# Altium schematic sheet A-00 COVER.SchDoc
size 513 x 386 mm
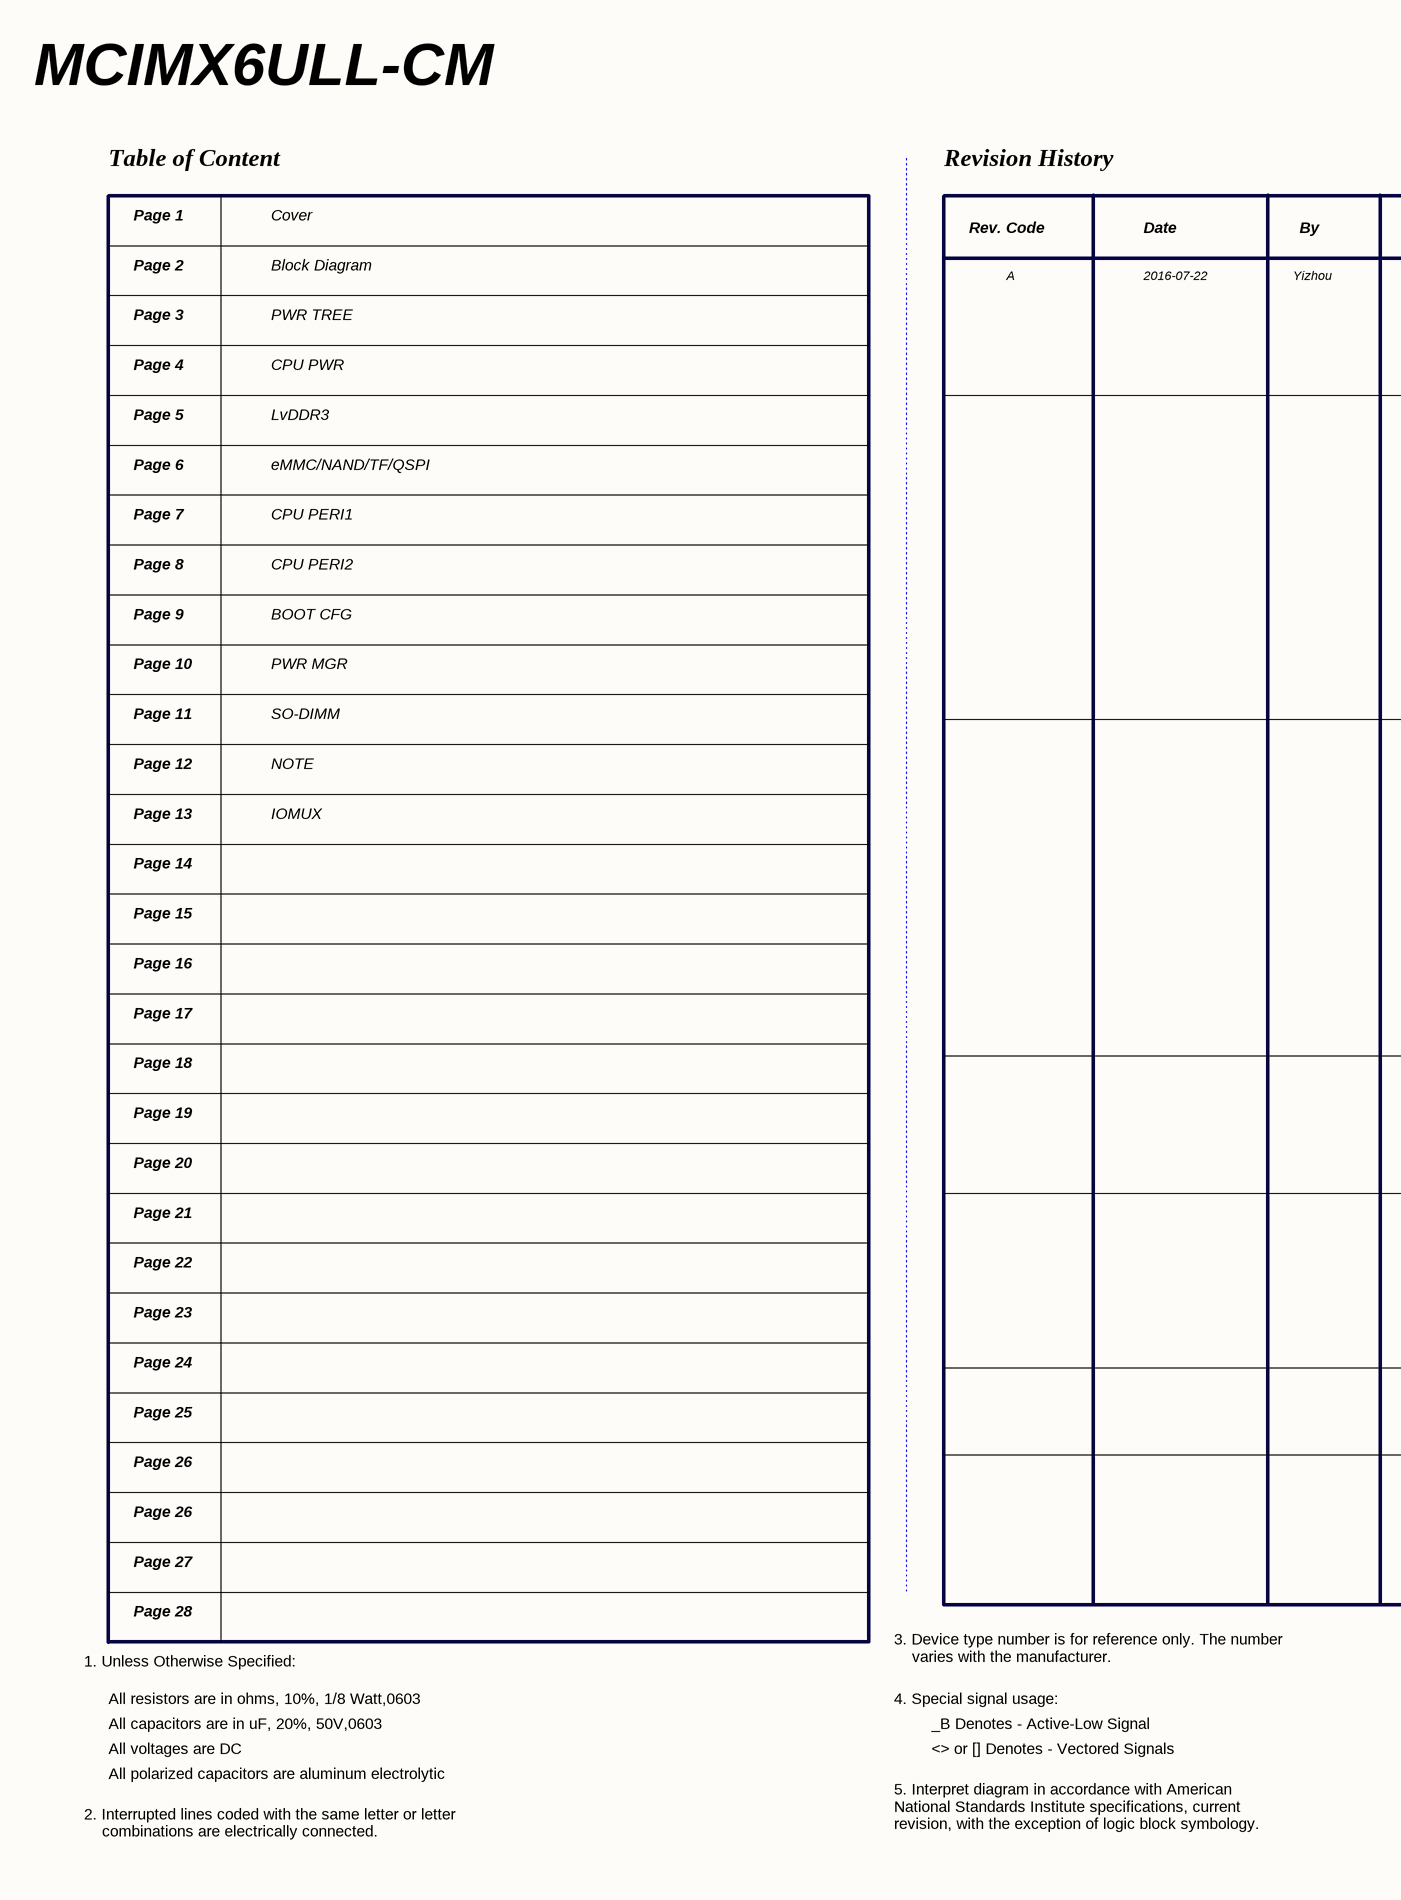
[diagram p0: A-00 COVER.SchDoc, left]
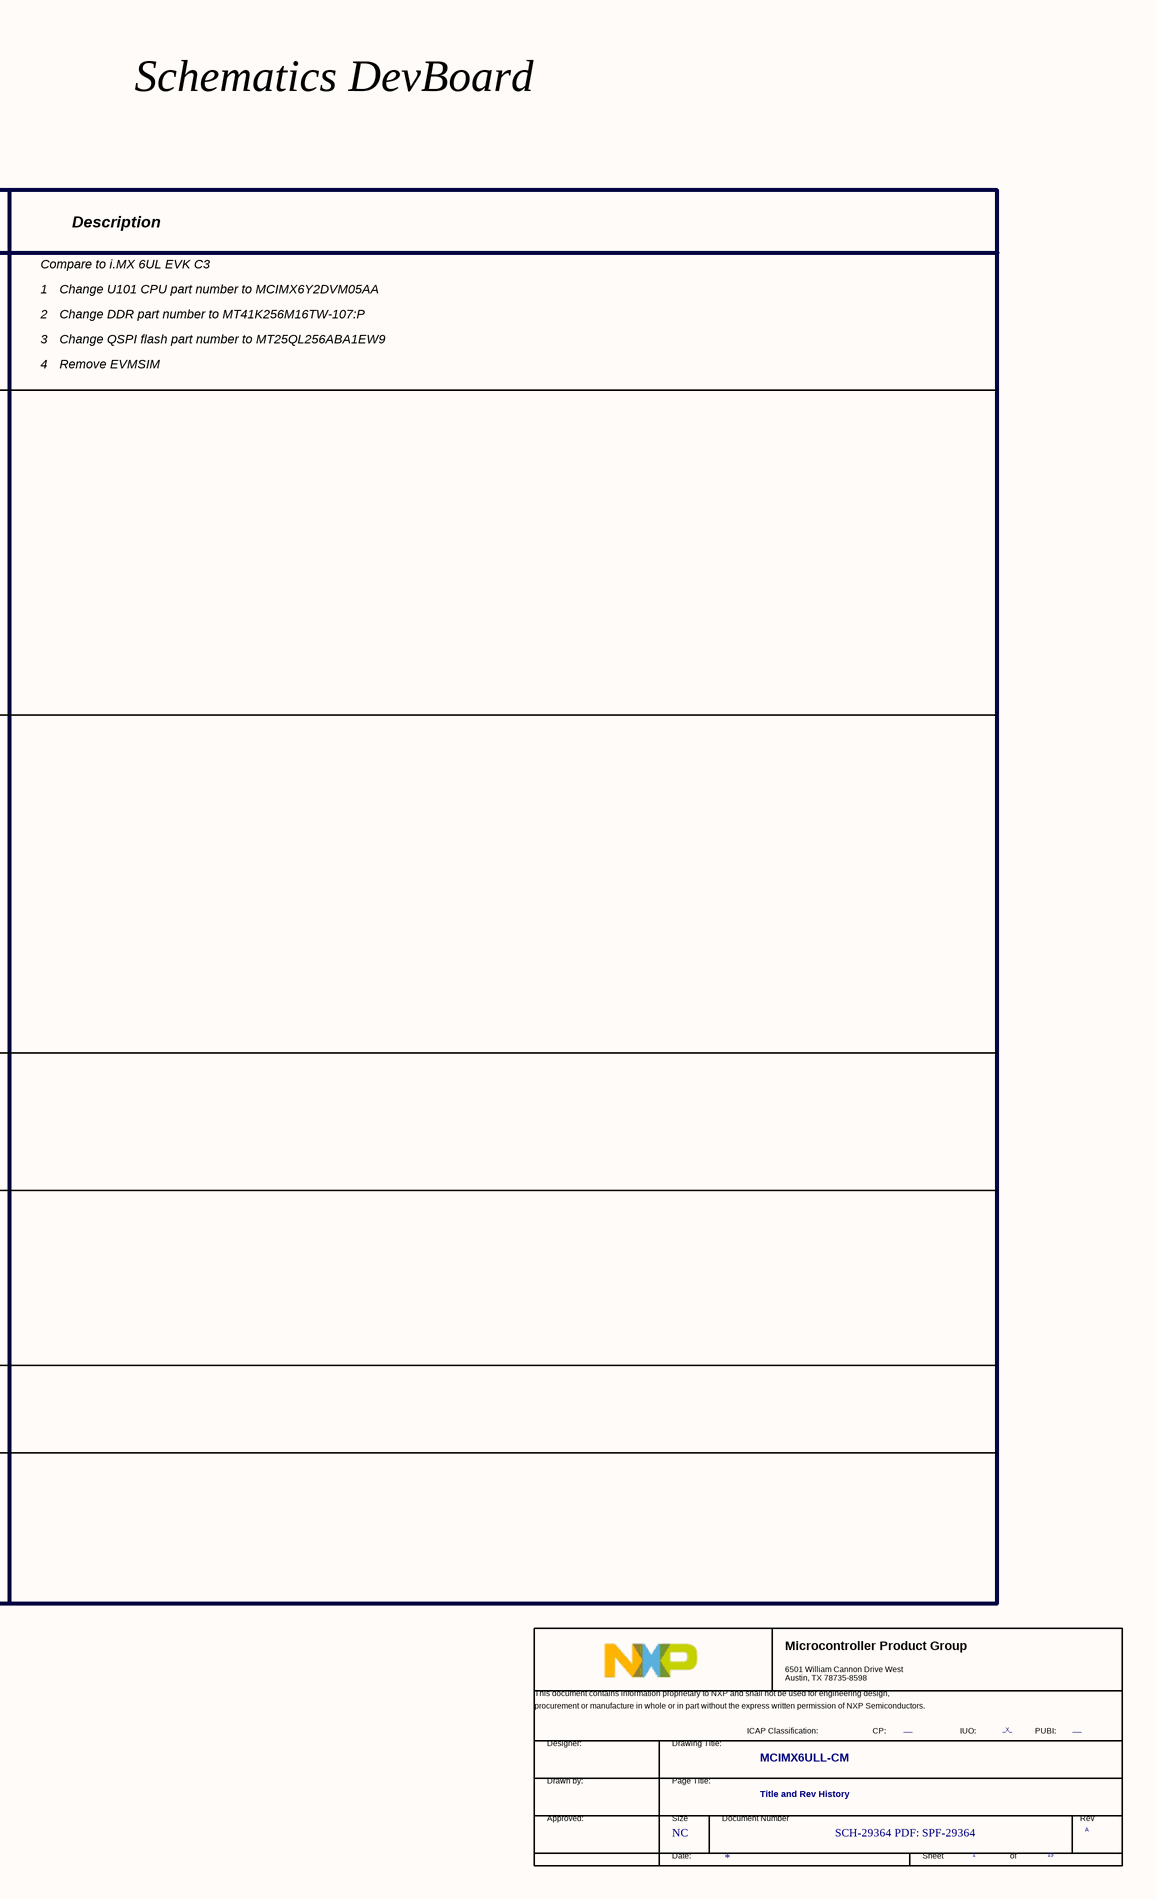
[diagram p1: A-00 COVER.SchDoc, right]

## Parts
*  Doc: SCH-29364 PDF: SPF-29364  RevCode: A  Title: MCIMX6ULL-CM  Page Size: NC  Page Number: 1  Page Count: 13  PageTitle: Title and Rev History  PUBI: ___  FIUO: _X_  (hidden comment: TitleBlock_MCPG)  (graphical)

## Notes on the sheet
- MCIMX6ULL-CM
- Schematics DevBoard
- Table of Content
- Page 1
- Cover
- Revision History
- Page 2
- Block Diagram
- Rev. Code
- A
- Date
- 2016-07-22
- Yizhou
- By
- Compare to i.MX 6UL EVK C3
- Description
- Page 3
- PWR TREE
- 1
- 2
- Change U101 CPU part number to MCIMX6Y2DVM05AA
- Change DDR part number to MT41K256M16TW-107:P
- Page 4
- CPU PWR
- 3
- 4
- Change QSPI flash part number to MT25QL256ABA1EW9
- Remove EVMSIM
- Page 5
- Page 6
- LvDDR3
- eMMC/NAND/TF/QSPI
- Page 7
- CPU PERI1
- Page 8
- CPU PERI2
- Page 9
- BOOT CFG
- Page 10
- Page 11
- SO-DIMM
- PWR MGR
- Page 12
- NOTE
- Page 13
- IOMUX
- Page 14
- Page 15
- Page 16
- Page 17
- Page 18
- Page 19
- Page 20
- Page 21
- Page 22
- Page 23
- Page 24
- Page 25
- Page 26
- Page 27
- Page 28
- 3. Device type number is for reference only. The number
  varies with the manufacturer.
- 1. Unless Otherwise Specified:
- All resistors are in ohms, 10%, 1/8 Watt,0603
- 4. Special signal usage:
- All capacitors are in uF, 20%, 50V,0603
- All voltages are DC
- All polarized capacitors are aluminum electrolytic
- 5. Interpret diagram in accordance with American
  National Standards Institute specifications, current
  revision, with the exception of logic block symbology.
- _B Denotes - Active-Low Signal
- <> or [] Denotes - Vectored Signals
- 2. Interrupted lines coded with the same letter or letter
  combinations are electrically connected.
- (in symbol TitleBlock_MCPG) Microcontroller Product Group; 6501 William Cannon Drive West / Austin, TX 78735-8598; This document contains information proprietary to NXP and shall not be used for engineering design,; procurement or manufacture in whole or in part without the express written permission of NXP Semiconductors.; ICAP Classification:; CP:; IUO:; PUBI:; Designer:; Drawing Title:; Drawn by:; Page Title:; Approved:; Size; Document Number; Rev; Date:; Sheet; of

## Library data of the parts
* = TitleBlock_MCPG: OrgAddr2: Austin, TX 78735-8598; OrgAddr1: 6501 William Cannon Drive West; OrgName: Freescale Semiconductor; Page Create Date: March  8, 1995; FCP: ___; Page Modify Date: *